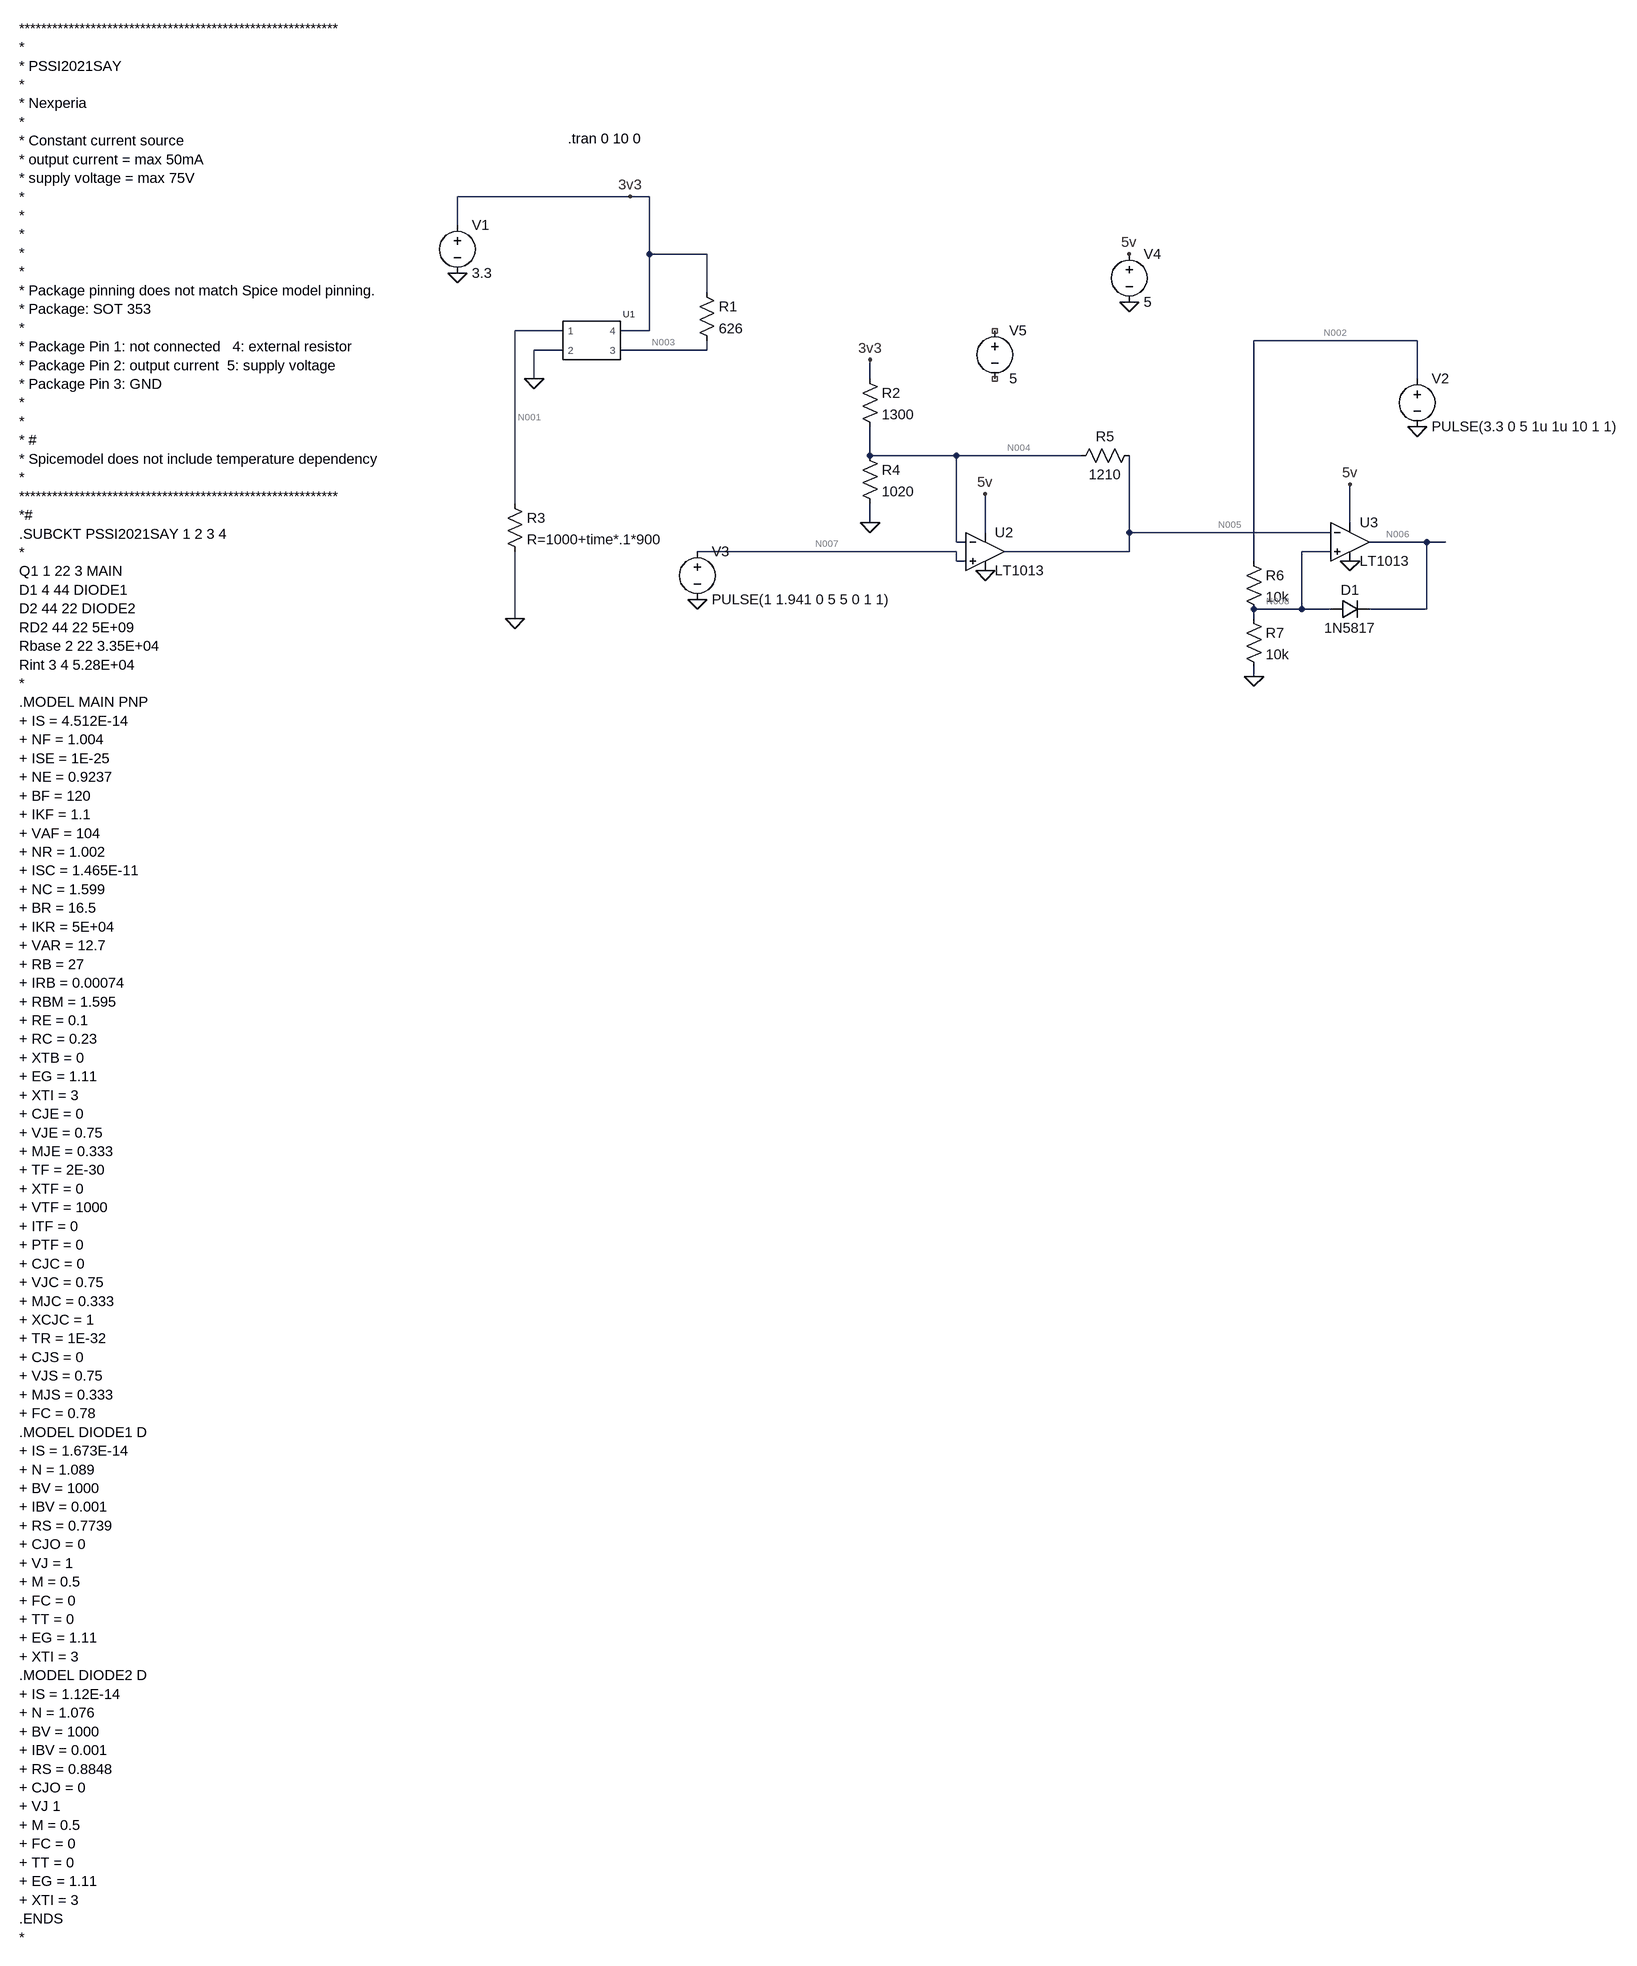
[diagram p0: schematic sensor_sim.asc]
sensor_sim.asc, the LTspice schematic file:
Version 4.1
SHEET 1 4424 2888
WIRE 2736 272 2448 272
WIRE 2768 272 2736 272
WIRE 2448 320 2448 272
WIRE 2768 368 2768 272
WIRE 2864 368 2768 368
WIRE 2864 432 2864 368
WIRE 2624 496 2544 496
WIRE 2768 496 2768 368
WIRE 2768 496 2720 496
WIRE 4048 512 3776 512
WIRE 2624 528 2576 528
WIRE 2864 528 2864 512
WIRE 2864 528 2720 528
WIRE 2576 576 2576 528
WIRE 3136 576 3136 544
WIRE 4048 576 4048 512
WIRE 3136 704 3136 656
WIRE 3280 704 3136 704
WIRE 3488 704 3280 704
WIRE 2544 784 2544 496
WIRE 3136 816 3136 784
WIRE 3936 816 3936 752
WIRE 3328 832 3328 768
WIRE 3568 832 3568 704
WIRE 3904 832 3568 832
WIRE 3280 848 3280 704
WIRE 3296 848 3280 848
WIRE 4064 848 3968 848
WIRE 4096 848 4064 848
WIRE 3280 864 2848 864
WIRE 3568 864 3568 832
WIRE 3568 864 3360 864
WIRE 3904 864 3856 864
WIRE 3280 880 3280 864
WIRE 3296 880 3280 880
WIRE 3776 880 3776 512
WIRE 3856 960 3856 864
WIRE 3856 960 3776 960
WIRE 3904 960 3856 960
WIRE 4064 960 4064 848
WIRE 4064 960 3968 960
WIRE 2544 976 2544 864
WIRE 3776 976 3776 960
WIRE 3776 1072 3776 1056
FLAG 2448 400 0
FLAG 2576 576 0
FLAG 2544 976 0
FLAG 3328 896 0
FLAG 2736 272 3v3
FLAG 3568 448 0
FLAG 3568 368 5v
FLAG 3328 768 5v
FLAG 2848 944 0
FLAG 3136 544 3v3
FLAG 3136 816 0
FLAG 3936 880 0
FLAG 3936 752 5v
FLAG 3776 1072 0
FLAG 4048 656 0
SYMBOL PSSI2021SAY 2672 512 R0
SYMATTR InstName U1
SYMBOL voltage 2448 304 R0
SYMATTR InstName V1
SYMATTR Value 3.3
SYMBOL res 2848 416 R0
SYMATTR InstName R1
SYMATTR Value 626
SYMBOL res 2528 768 R0
SYMATTR InstName R3
SYMATTR Value R=1000+time*.1*900
SYMBOL OpAmps\\LT1013 3328 800 R0
SYMATTR InstName U2
SYMBOL res 3584 688 R90
WINDOW 0 0 56 VBottom 2
WINDOW 3 32 56 VTop 2
SYMATTR InstName R5
SYMATTR Value 1210
SYMBOL voltage 3568 352 R0
WINDOW 123 0 0 Left 0
WINDOW 39 0 0 Left 0
SYMATTR InstName V4
SYMATTR Value 5
SYMBOL voltage 2848 848 R0
WINDOW 123 0 0 Left 0
WINDOW 39 0 0 Left 0
SYMATTR InstName V3
SYMATTR Value PULSE(1 1.941 0 5 5 0 1 1)
SYMBOL res 3120 560 R0
SYMATTR InstName R2
SYMATTR Value 1300
SYMBOL res 3120 688 R0
SYMATTR InstName R4
SYMATTR Value 1020
SYMBOL OpAmps\\LT1013 3936 784 R0
SYMATTR InstName U3
SYMBOL res 3760 864 R0
SYMATTR InstName R6
SYMATTR Value 10k
SYMBOL res 3760 960 R0
SYMATTR InstName R7
SYMATTR Value 10k
SYMBOL diode 3904 976 R270
WINDOW 0 32 32 VTop 2
WINDOW 3 0 32 VBottom 2
SYMATTR InstName D1
SYMATTR Value 1N5817
SYMATTR Description Diode
SYMATTR Type diode
SYMBOL voltage 4048 560 R0
WINDOW 123 0 0 Left 0
WINDOW 39 0 0 Left 0
SYMATTR InstName V2
SYMATTR Value PULSE(3.3 0 5 1u 1u 10 1 1)
SYMBOL voltage 3344 480 R0
WINDOW 123 0 0 Left 0
WINDOW 39 0 0 Left 0
SYMATTR InstName V5
SYMATTR Value 5
TEXT 64 -8 Left 2 !**********************************************************\n*\n* PSSI2021SAY\n*\n* Nexperia\n*\n* Constant current source\n* output current = max 50mA\n* supply voltage = max 75V \n*\n*\n*\n*\n*\n* Package pinning does not match Spice model pinning.\n* Package: SOT 353\n*  \n* Package Pin 1: not connected   4: external resistor\n* Package Pin 2: output current  5: supply voltage\n* Package Pin 3: GND\n*\n* \n* #\n* Spicemodel does not include temperature dependency\n*\n**********************************************************\n*#\n.SUBCKT PSSI2021SAY 1 2 3 4\n*\nQ1 1 22 3 MAIN\nD1 4 44 DIODE1\nD2 44 22 DIODE2\nRD2 44 22 5E+09\nRbase 2 22 3.35E+04\nRint 3 4 5.28E+04\n*\n.MODEL MAIN PNP\n+ IS = 4.512E-14\n+ NF = 1.004\n+ ISE = 1E-25\n+ NE = 0.9237\n+ BF = 120\n+ IKF = 1.1\n+ VAF = 104\n+ NR = 1.002\n+ ISC = 1.465E-11\n+ NC = 1.599\n+ BR = 16.5\n+ IKR = 5E+04\n+ VAR = 12.7\n+ RB = 27\n+ IRB = 0.00074\n+ RBM = 1.595\n+ RE = 0.1\n+ RC = 0.23\n+ XTB = 0\n+ EG = 1.11\n+ XTI = 3\n+ CJE = 0\n+ VJE = 0.75\n+ MJE = 0.333\n+ TF = 2E-30\n+ XTF = 0\n+ VTF = 1000\n+ ITF = 0\n+ PTF = 0\n+ CJC = 0\n+ VJC = 0.75\n+ MJC = 0.333\n+ XCJC = 1\n+ TR = 1E-32\n+ CJS = 0\n+ VJS = 0.75\n+ MJS = 0.333\n+ FC = 0.78\n.MODEL DIODE1 D\n+ IS = 1.673E-14\n+ N = 1.089\n+ BV = 1000\n+ IBV = 0.001\n+ RS = 0.7739\n+ CJO = 0\n+ VJ = 1\n+ M = 0.5\n+ FC = 0\n+ TT = 0\n+ EG = 1.11\n+ XTI = 3\n.MODEL DIODE2 D\n+ IS = 1.12E-14\n+ N = 1.076\n+ BV = 1000\n+ IBV = 0.001\n+ RS = 0.8848\n+ CJO = 0\n+ VJ 1\n+ M = 0.5\n+ FC = 0\n+ TT = 0\n+ EG = 1.11\n+ XTI = 3\n.ENDS\n*
TEXT 2632 176 Left 2 !.tran 0 10 0

The netlist it stands for:
* sensor_sim.asc
X§U1 N001 0 N003 3v3 PSSI2021SAY  ; pins 1 2 3 4
V1 3v3 0 3.3
R1 3v3 N003 626
R3 N001 0 R=1000+time*.1*900
X§U2 N007 N004 5v 0 N005 LT1013  ; pins In+ In- V+ V- OUT
R5 N005 N004 1210
V4 5v 0 5
V3 N007 0 PULSE(1 1.941 0 5 5 0 1 1)
R2 3v3 N004 1300
R4 N004 0 1020
X§U3 N008 N005 5v 0 N006 LT1013  ; pins In+ In- V+ V- OUT
R6 N002 N008 10k
R7 N008 0 10k
D1 N008 N006 1N5817
V2 N002 0 PULSE(3.3 0 5 1u 1u 10 1 1)
V5 NC_01 NC_02 5
.model D D
.lib standard.dio
**********************************************************
*
* PSSI2021SAY
*
* Nexperia
*
* Constant current source
* output current = max 50mA
* supply voltage = max 75V
*
*
*
*
*
* Package pinning does not match Spice model pinning.
* Package: SOT 353
*
* Package Pin 1: not connected   4: external resistor
* Package Pin 2: output current  5: supply voltage
* Package Pin 3: GND
*
*
* #
* Spicemodel does not include temperature dependency
*
**********************************************************
*#
.SUBCKT PSSI2021SAY 1 2 3 4
*
Q1 1 22 3 MAIN
D1 4 44 DIODE1
D2 44 22 DIODE2
RD2 44 22 5E+09
Rbase 2 22 3.35E+04
Rint 3 4 5.28E+04
*
.MODEL MAIN PNP
+ IS = 4.512E-14
+ NF = 1.004
+ ISE = 1E-25
+ NE = 0.9237
+ BF = 120
+ IKF = 1.1
+ VAF = 104
+ NR = 1.002
+ ISC = 1.465E-11
+ NC = 1.599
+ BR = 16.5
+ IKR = 5E+04
+ VAR = 12.7
+ RB = 27
+ IRB = 0.00074
+ RBM = 1.595
+ RE = 0.1
+ RC = 0.23
+ XTB = 0
+ EG = 1.11
+ XTI = 3
+ CJE = 0
+ VJE = 0.75
+ MJE = 0.333
+ TF = 2E-30
+ XTF = 0
+ VTF = 1000
+ ITF = 0
+ PTF = 0
+ CJC = 0
+ VJC = 0.75
+ MJC = 0.333
+ XCJC = 1
+ TR = 1E-32
+ CJS = 0
+ VJS = 0.75
+ MJS = 0.333
+ FC = 0.78
.MODEL DIODE1 D
+ IS = 1.673E-14
+ N = 1.089
+ BV = 1000
+ IBV = 0.001
+ RS = 0.7739
+ CJO = 0
+ VJ = 1
+ M = 0.5
+ FC = 0
+ TT = 0
+ EG = 1.11
+ XTI = 3
.MODEL DIODE2 D
+ IS = 1.12E-14
+ N = 1.076
+ BV = 1000
+ IBV = 0.001
+ RS = 0.8848
+ CJO = 0
+ VJ 1
+ M = 0.5
+ FC = 0
+ TT = 0
+ EG = 1.11
+ XTI = 3
.ENDS
*
.tran 0 10 0
.lib LTC.lib
.backanno
.end

* Results of the author's LTspice run, read from the files saved beside the schematic
* Operating Point, zero values left out:
*   V(n003) = 2.683 V
*   V(n007) = 1 V
*   V(n004) = 1.018 V
*   V(n005) = 102.2 mV
*   V(n002) = 3.3 V
*   V(n001) = 988.2 mV
*   V(3v3) = 3.3 V
*   V(5v) = 5 V
*   V(n008) = 1.809 V
*   V(n006) = 4.416 V
*   I(R4) = 998.2 µA
*   I(R6) = 149.1 µA
*   I(R1) = 985.1 µA
*   I(V4) = -403.3 µA
*   I(V3) = 12.19 nA
*   I(D1) = -31.7 µA
*   I(V2) = -149.1 µA
*   I(V1) = -2.805 mA
*   I(R3) = 988.2 µA
*   I(R5) = -757 µA
*   I(R2) = 1.755 mA
*   I(R7) = 180.9 µA
*   Ix(u2:1) = -12.19 nA
*   Ix(u2:2) = -12.11 nA
*   Ix(u2:3) = 46.82 µA
*   Ix(u2:4) = -801 µA
*   Ix(u2:5) = 757 µA
*   Ix(u1:1) = -988.2 µA
*   Ix(u1:2) = -61.6 µA
*   Ix(u1:3) = 985.1 µA
*   Ix(u1:4) = 64.71 µA
*   Ix(u3:1) = -8.147 nA
*   Ix(u3:2) = -16.16 nA
*   Ix(u3:3) = 356.5 µA
*   Ix(u3:4) = -334.3 µA
*   Ix(u3:5) = -31.7 µA
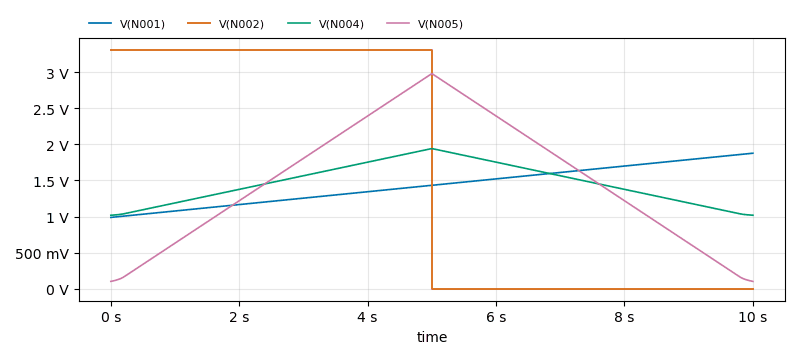
[diagram p1: Transient Analysis of sensor_sim.asc, plotted from the saved traces]
* Transient Analysis, 1 run:
*   V(N001): min 988.2 mV, max 1.876 V, average 1.432 V, rms 1.456 V, last 1.876 V
*   V(N002): min 0 V, max 3.3 V, average 1.65 V, rms 2.333 V, last 0 V
*   V(N004): min 1.018 V, max 1.941 V, average 1.471 V, rms 1.499 V, last 1.018 V
*   V(N005): min 102.2 mV, max 2.979 V, average 1.513 V, rms 1.762 V, last 102.2 mV